# Altium project DC-DC_Buck_Converter.PrjPcb
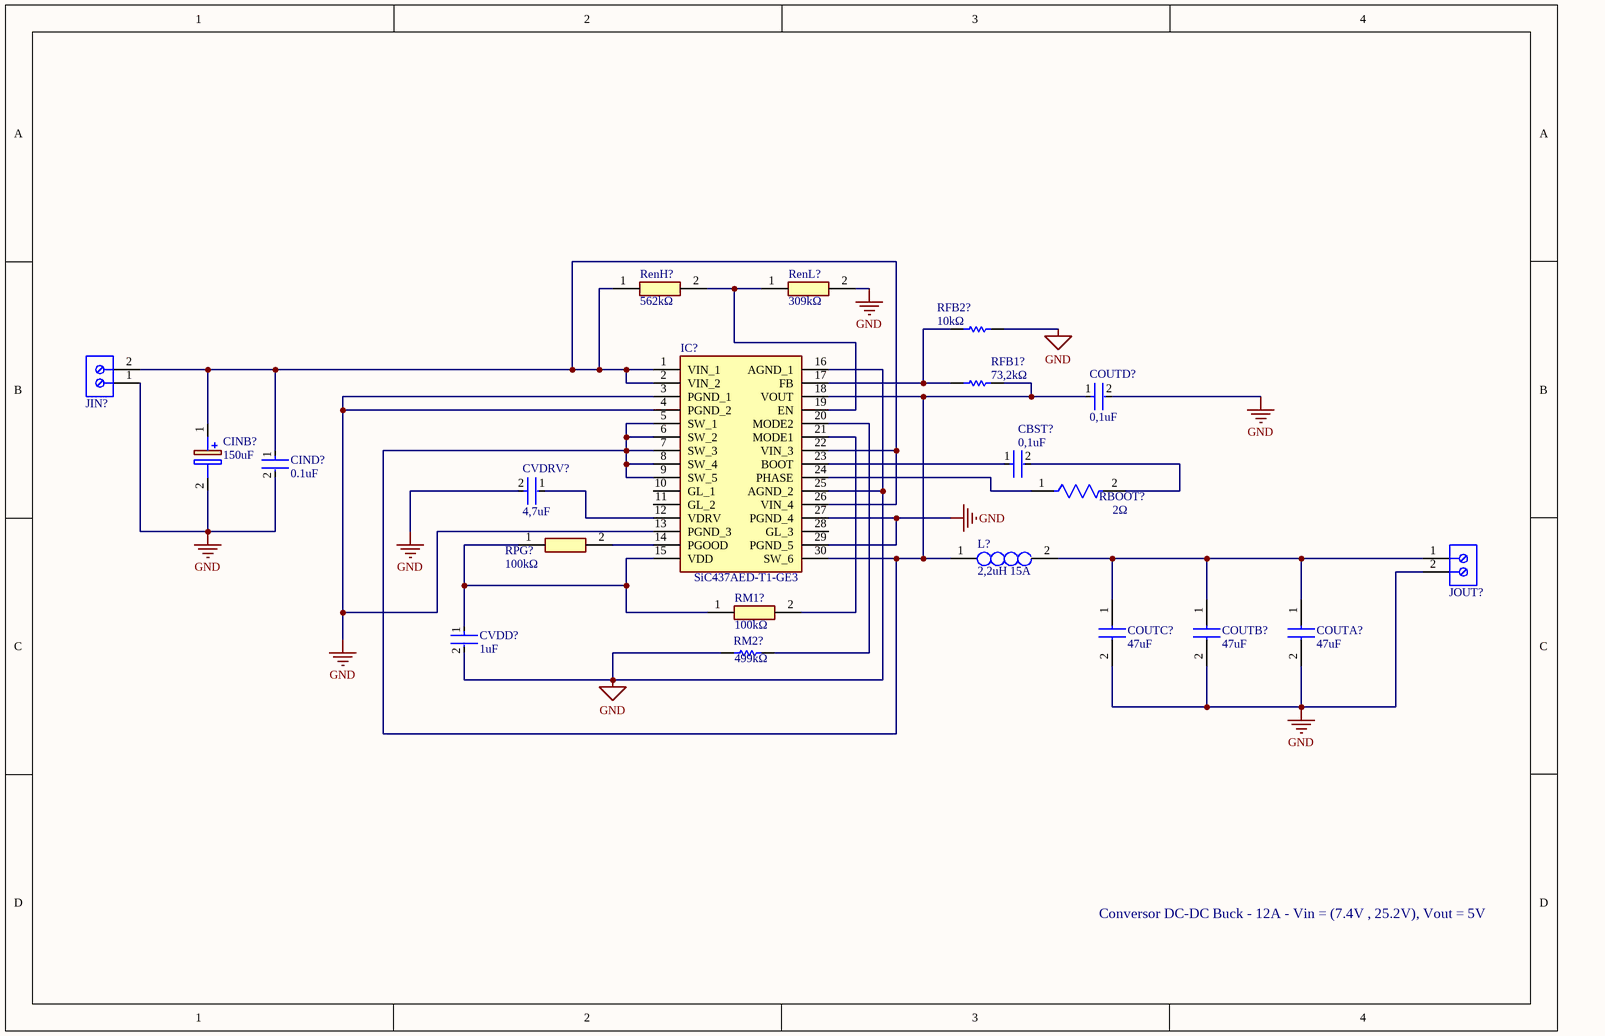
[diagram p0: DC-DC_Buck_Converter.SchDoc]
1 sheet, 21 parts. Net scope: global (net labels, ports and power ports of the same name join across sheets).
Board file: DC-DC_Buck_Converter.PcbDoc

## Sheet DC-DC_Buck_Converter.SchDoc
size A4; SheetNumber: 1; SheetTotal: 1

### Parts
CBST?  0,1uF  [FP-0603-L_1_6_0_15-W_0_81-IPC_A]
CINB?  150uF  [CAPPRD750W80D1625H2150]
CIND?  0.1uF  [FP-0603-L_1_6_0_1-W_0_8_0-MFG]
COUTA?  47uF  [CAPC3225X279N]
COUTB?  47uF  [CAPC3225X279N]
COUTC?  47uF  [CAPC3225X279N]
COUTD?  0,1uF  [FP-0603-L_1_6_0_15-W_0_81-IPC_A]
CVDD?  1uF  [FP-GCM21B-0_15-IPC_A]
CVDRV?  4,7uF  [FP-GRM219-0_15-0_1-IPC_B]
IC?  SiC437AED-T1-GE3  [SIC437DEDT1GE3]
JIN?  691102710002  [691102710002]  (value not drawn)
JOUT?  691102710002  [691102710002]  (value not drawn)
L?  2,2uH 15A  [INDPM110100X400N]
RBOOT?  2Ω  [FP-ESR03-MFG]
RenH?  562kΩ  [ERJP06D1000V]
RenL?  309kΩ  [ERJP06D1000V]
RFB1?  73,2kΩ  [RESC2013X60X40ML20T25]
RFB2?  10kΩ  [RESC2013X60X40LL20T25_A]
RM1?  100kΩ  [ERA3AEB101V]
RM2?  499kΩ  [RESC2013X60X40ML20T25]
RPG?  100kΩ  [ERA3AEB101V]

### Nets
GND: CINB?.2(-) CIND?.2 COUTA?.2 COUTB?.2 COUTC?.2 COUTD?.2 CVDD?.2 CVDRV?.2 IC?.3(PGND_1) IC?.4(PGND_2) IC?.13(PGND_3) IC?.16(AGND_1) IC?.25(AGND_2) IC?.27(PGND_4) IC?.29(PGND_5) JIN?.1 JOUT?.2 RenL?.2 RFB2?.2 RM2?.1
NetCBST?_1: CBST?.1 IC?.23(BOOT)
NetCBST?_2: CBST?.2 RBOOT?.2
NetCINB?_1: CINB?.1(+) CIND?.1 IC?.1(VIN_1) IC?.2(VIN_2) IC?.22(VIN_3) IC?.26(VIN_4) JIN?.2 RenH?.1
NetCOUTA?_1: COUTA?.1 COUTB?.1 COUTC?.1 JOUT?.1 L?.2
NetCOUTD?_1: COUTD?.1 IC?.5(SW_1) IC?.6(SW_2) IC?.7(SW_3) IC?.8(SW_4) IC?.9(SW_5) IC?.18(VOUT) IC?.30(SW_6) L?.1 RFB1?.2
NetCVDD?_1: CVDD?.1 IC?.15(VDD) RM1?.1 RPG?.1
NetCVDRV?_1: CVDRV?.1 IC?.12(VDRV)
NetIC?_14: IC?.14(PGOOD) RPG?.2
NetIC?_17: IC?.17(FB) RFB1?.1 RFB2?.1
NetIC?_19: IC?.19(EN) RenH?.2 RenL?.1
NetIC?_20: IC?.20(MODE2) RM2?.2
NetIC?_21: IC?.21(MODE1) RM1?.2
NetIC?_24: IC?.24(PHASE) RBOOT?.1

Not connected (* = marked no-connect by the designer): IC? 10(GL_1) 11(GL_2) 28(GL_3)

### Notes on the sheet
- Conversor DC-DC Buck - 12A - Vin = (7.4V , 25.2V), Vout = 5V

### Library data of the parts
CBST? COUTD? = CMP-2006-04388-2: 06035C104K4Z2A, Automotive Ceramic Capacitor, 0603, 100nF, 10%, X7R, 15%, 50V; Dissipation Factor: 2.5%; Radiation Hardening: No; Max Operating Temperature: 125°C; Features: Soft Termination; Thickness: 0.037inch; Tolerance: 10%; Case Code (Metric): 1608; Dielectric: X7R; Voltage Rating: 50V; Mount: Surface Mount; Width: 0.81mm; Package Quantity: 1; Contact Plating: Tin; Case/Package: 0603; Capacitance: 100nF; Length: 1.6mm; Series: FLEXITERM®; REACH SVHC: No SVHC; Ratings: AEC-Q200; Termination: SMD/SMT; Lead Free: Lead Free; Height: 0.035mm; Number of Pins: 2; RoHS Compliant: Yes; Case Code (Imperial): 0603; Voltage Rating (DC): 50V; Construction: Flat; Depth: 0.81mm; Min Operating Temperature: -55°C; Packaging: Tape and Reel
CINB? = UCS2C151MHD: UCS2C151MHD, Aluminum Electrolytic Capacitors - Radial Leaded 160volts 150uF 16X20 20%, Capacitor Polarised; Manufacturer_Name: Nichicon; Datasheet Link: https://www.nichicon.co.jp/english/products/pdfs/e-ucs.pdf; Height: 21.5mm; Manufacturer_Part_Number: UCS2C151MHD; Mouser Part Number: 647-UCS2C151MHD; Mouser Price/Stock: https://www.mouser.com/Search/Refine.aspx?Keyword=647-UCS2C151MHD; Arrow Part Number: UCS2C151MHD; Arrow Price/Stock: https://www.arrow.com/en/products/ucs2c151mhd/nichicon
CIND? = CMP-14477-002194-3: GMK107BJ104KAHT, Ceramic Capacitor Automotive 0.1uF ±10% 35V X5R 0603; NexarPartId: 29103042; Capacitance: 100nF; Width: 800µm; Voltage Rating (DC): 35V; Voltage Rating: 35V; Min Width: 700µm; Case Code (Imperial): 0603; Case Code (Metric): 1608; Length: 1.6002mm; Min Length: 1.5mm; Ratings: AEC-Q200; Max Length: 1.7mm; Height: 900µm; Mount: Surface Mount; Lead Free: Lead Free; Material: Ceramic; Packaging: Digi-Reel®; Max Operating Temperature: 85°C; Termination: SMD/SMT; Dielectric: X5R; Min Operating Temperature: -55°C; Halogen Free: Halogen Free; Tolerance: 10%; Min Thickness: 700µm; Max Thickness: 900µm; Thickness: 889µm; Case/Package: 0603; RoHS: Compliant; Max Width: 900µm
COUTA? COUTB? COUTC? = 1210YD476KAT4A: 1210YD476KAT4A, Capacitor, 16V, ripple 2A; Manufacturer_Name: Kyocera AVX; Datasheet Link: https://eu.mouser.com/datasheet/2/40/cx5r-776519.pdf; Height: 2.79mm; Manufacturer_Part_Number: 1210YD476KAT4A; Mouser Part Number: 581-1210YD476KAT4A; Mouser Price/Stock: https://www.mouser.com/Search/Refine.aspx?Keyword=581-1210YD476KAT4A
CVDD? = CMP-2007-03345-2: GCM21BR71E105KA56K, Ceramic Capacitor for Automotive 1uF ±10% 25VDC X7R 0805 Embossed T/R; Voltage Rating (DC): 25V; Packaging: Tape and Reel; Dielectric: X7R; Termination: SMD/SMT; Mount: Surface Mount; Package Quantity: 10000; Tolerance: 10%; Thickness: 0.055inch; Width: 0.049inch; Case/Package: 0805; Construction: Flat; Height: 1.25mm; Case Code (Imperial): 0805; Radiation Hardening: No; Series: GCM; Max Operating Temperature: 125°C; Case Code (Metric): 2012; Voltage Rating: 25V; Length: 2mm; Depth: 1.25mm; Capacitance: 1uF; Ratings: AEC-Q200; Min Operating Temperature: -55°C
CVDRV? = CMP-06035-049019-1: GRM219R6YA475KA73D, Chip Multilayer Ceramic Capacitors for General Purpose, 0805, 4.7uF, X5R, 15%, 10%, 35V; Voltage Rating: 35V; Mount: Surface Mount; Voltage: 35V; Width: 1.25mm; Tolerance: 10%; Height: 0.85mm; Termination: SMD/SMT; Max Operating Temperature: 85°C; Case/Package: 0805; Thickness: 0.037inch; Dielectric Material: Ceramic; Packaging: Tape and Reel; Lead Free: Lead Free; Package Quantity: 1; Depth: 1.25mm; Case Code (Metric): 2012; Weight: 0.000335oz; Voltage Rating (DC): 35V; Case Code (Imperial): 0805; Min Operating Temperature: -55°C; Capacitance: 4.7uF; Material: Ceramic; Dielectric: X5R; Length: 2mm
IC? = SiC437AED-T1-GE3: Integrated Circuit; Manufacturer_Name: Vishay; Datasheet Link: https://www.mouser.fr/datasheet/2/427/sic437-1670527.pdf; Height: 0.8mm; Manufacturer_Part_Number: SiC437AED-T1-GE3; Mouser Part Number: 78-SIC437AED-T1-GE3; Mouser Price/Stock: https://www.mouser.co.uk/ProductDetail/Vishay-Siliconix/SIC437AED-T1-GE3?qs=chTDxNqvsyloQdgCHbSYaQ%3D%3D; Arrow Part Number: SIC437AED-T1-GE3; Arrow Price/Stock: https://www.arrow.com/en/products/sic437aed-t1-ge3/vishay?utm_currency=USD&region=nac
JIN? JOUT? = CMP-1502-03258-2: NexarPartId: 8917706; Number of Levels: 1; Number of Positions Per Level: 2; Current: 15A; Voltage: 300V; Pitch: 5.0038mm; Plating: Steel; Stripping Length: -6mm; Wire Gauge (Min): 14AWG; Wire Gauge (Max): 22AWG; Length: 7.5mm; Contact Material: Brass; Contact Plating: Tin; Packaging: Box; Number of Pins: 2; Voltage Rating: 300V; Termination: Screw; Number of Contacts: 2; Color: Blue; Current Rating: 15A; Mount: Through Hole; Max Operating Temperature: 105°C; Min Operating Temperature: -40°C; REACH SVHC: Unknown; Height: 13.4mm; Width: 11.2mm; Housing Material: Nylon; RoHS: Compliant; Wire/Cable Gauge: 22AWG; Lead Pitch: 5mm
L? = SRP1038CC-2R2M: SRP1038CC-2R2M, Inductor, 15A; Manufacturer_Name: Bourns; Datasheet Link: https://www.bourns.com/docs/Product-Datasheets/SRP1038CC.pdf; Height: 4mm; Manufacturer_Part_Number: SRP1038CC-2R2M; Mouser Part Number: 652-SRP1038CC-2R2M; Mouser Price/Stock: https://www.mouser.co.uk/ProductDetail/Bourns/SRP1038CC-2R2M?qs=1Kr7Jg1SGW%252BcvKpILw06dA%3D%3D
RBOOT? = CMP-08839-010261-1: ESR03EZPJ2R0, 2Ω ±5% 0.25W 0603 Anti-Surge Chip Resistor AEC-Q200; Max Power Dissipation: 250mW; Temperature Coefficient: 200ppm/°C; Resistance: 2R; Features: Automotive AEC-Q200; Resistor Type: Thick Film; Case Code (Imperial): 0603; Package Quantity: 5000; Series: ESR; Case/Package: 0603; Height: 0.022inch; Tolerance: 5%; Length: 0.063inch; RoHS Compliant: Yes; Number of Terminations: 2; Max Operating Temperature: 155°C; Case Code (Metric): 1608; Min Operating Temperature: -55°C; Packaging: Cut Tape; Width: 0.031inch
RenH? = ERJ-P06F5623V: ERJ-P06F5623V, Resistor, 080, 562kΩ , 1% tolerance, 1/2W; Manufacturer_Name: Panasonic; Datasheet Link: http://industrial.panasonic.com/cdbs/www-data/pdf/RDA0000/AOA0000C102.pdf; Height: 0.7mm; Manufacturer_Part_Number: ERJ-P06F5623V
RenL? = ERJ-P06F3093V: ERJ-P06F3093V, Resistor, 309kΩ, 1% tolerance, 1/2W, 0805; Manufacturer_Name: Panasonic; Datasheet Link: http://industrial.panasonic.com/cdbs/www-data/pdf/RDA0000/AOA0000C102.pdf; Height: 0.7mm; Manufacturer_Part_Number: ERJ-P06F3093V; Mouser Part Number: 667-ERJ-P06F3093V; Mouser Price/Stock: https://www.mouser.co.uk/ProductDetail/Panasonic/ERJ-P06F3093V?qs=iIVTEDlrHA1HCCmB5VX2HQ%3D%3D
RFB1? = CMP-2001-00876-1: ERA6AEB7322V, resistor , 73,2kΩ , 0.1% tolerance, 1/8W; Manufacturer: Panasonic; Part Number: ERA6AEB7322V
RFB2? = CMP-2001-00582-2: ERA-6AEB103V, Metal Film Chip Resistor, High Reliability Type, 0.125 W, +/- 0.1%, -55 to 155 degC, 0805 (2012 Metric), RoHS, Tape and Reel; Voltage Rating: 100V; Power Rating: 125mW(1/8W); Brand: Panasonic; Temperature Coefficient: 25PPM/C; Resistance: 10kOhms; Product Category: ThinFilmResistors-SMD; Datasheet Version: 02/2016; Operating Temperature Range: -55Cto+155C; Length: 2mm; Mounting Technology: SurfaceMount; Manufacturer URL: http://www.panasonic.com/; Width: 1.25mm; Packaging: Reel; Product: ThinFilmResistorsSMD; Package / Case: 0805(2012metric); Termination Style: SMD/SMT; Tolerance: 0.1%; Datasheet URL: https://industrial.panasonic.com/cdbs/www-data/pdf/RDM0000/AOA0000C307.pdf; Package Description: 2-Pin Surface Mount Device, Body 2 x 1.25 mm; Factory Pack Quantity: 5000; Series: ERA-6A; Case Code - mm: 2012; RoHS: Details; Package Reference: 0805; Height: 0.5mm; Manufacturer: Panasonic; Case Code - in: 0805; Type: MetalFilmChipResistors
RM1? RPG? = ERA-3AED104V: ERA-3AED104V, 100kΩ, 0,5% tolerance, 1/10W ,75V , Resistor; Manufacturer_Name: Panasonic; Datasheet Link: https://industrial.panasonic.com/cdbs/www-data/pdf/RDM0000/AOA0000C307.pdf; Height: 0.55mm; Manufacturer_Part_Number: ERA-3AED104V; Mouser Part Number: 667-ERA-3AED104V; Mouser Price/Stock: https://www.mouser.co.uk/ProductDetail/Panasonic/ERA-3AED104V?qs=MNPzkKEzRtQIWcmUWL4kjg%3D%3D
RM2? = CMP-2001-00840-1: ERA6AEB4993V, resistor, 499kΩ, 0.1% tolerance, 100V, 1/8W, 0805; Manufacturer: Panasonic; Part Number: ERA6AEB4993V